# EAGLE design Messchieber_Bluetooth_2 (EAGLE 6.4)

## Sheet 1 of 3
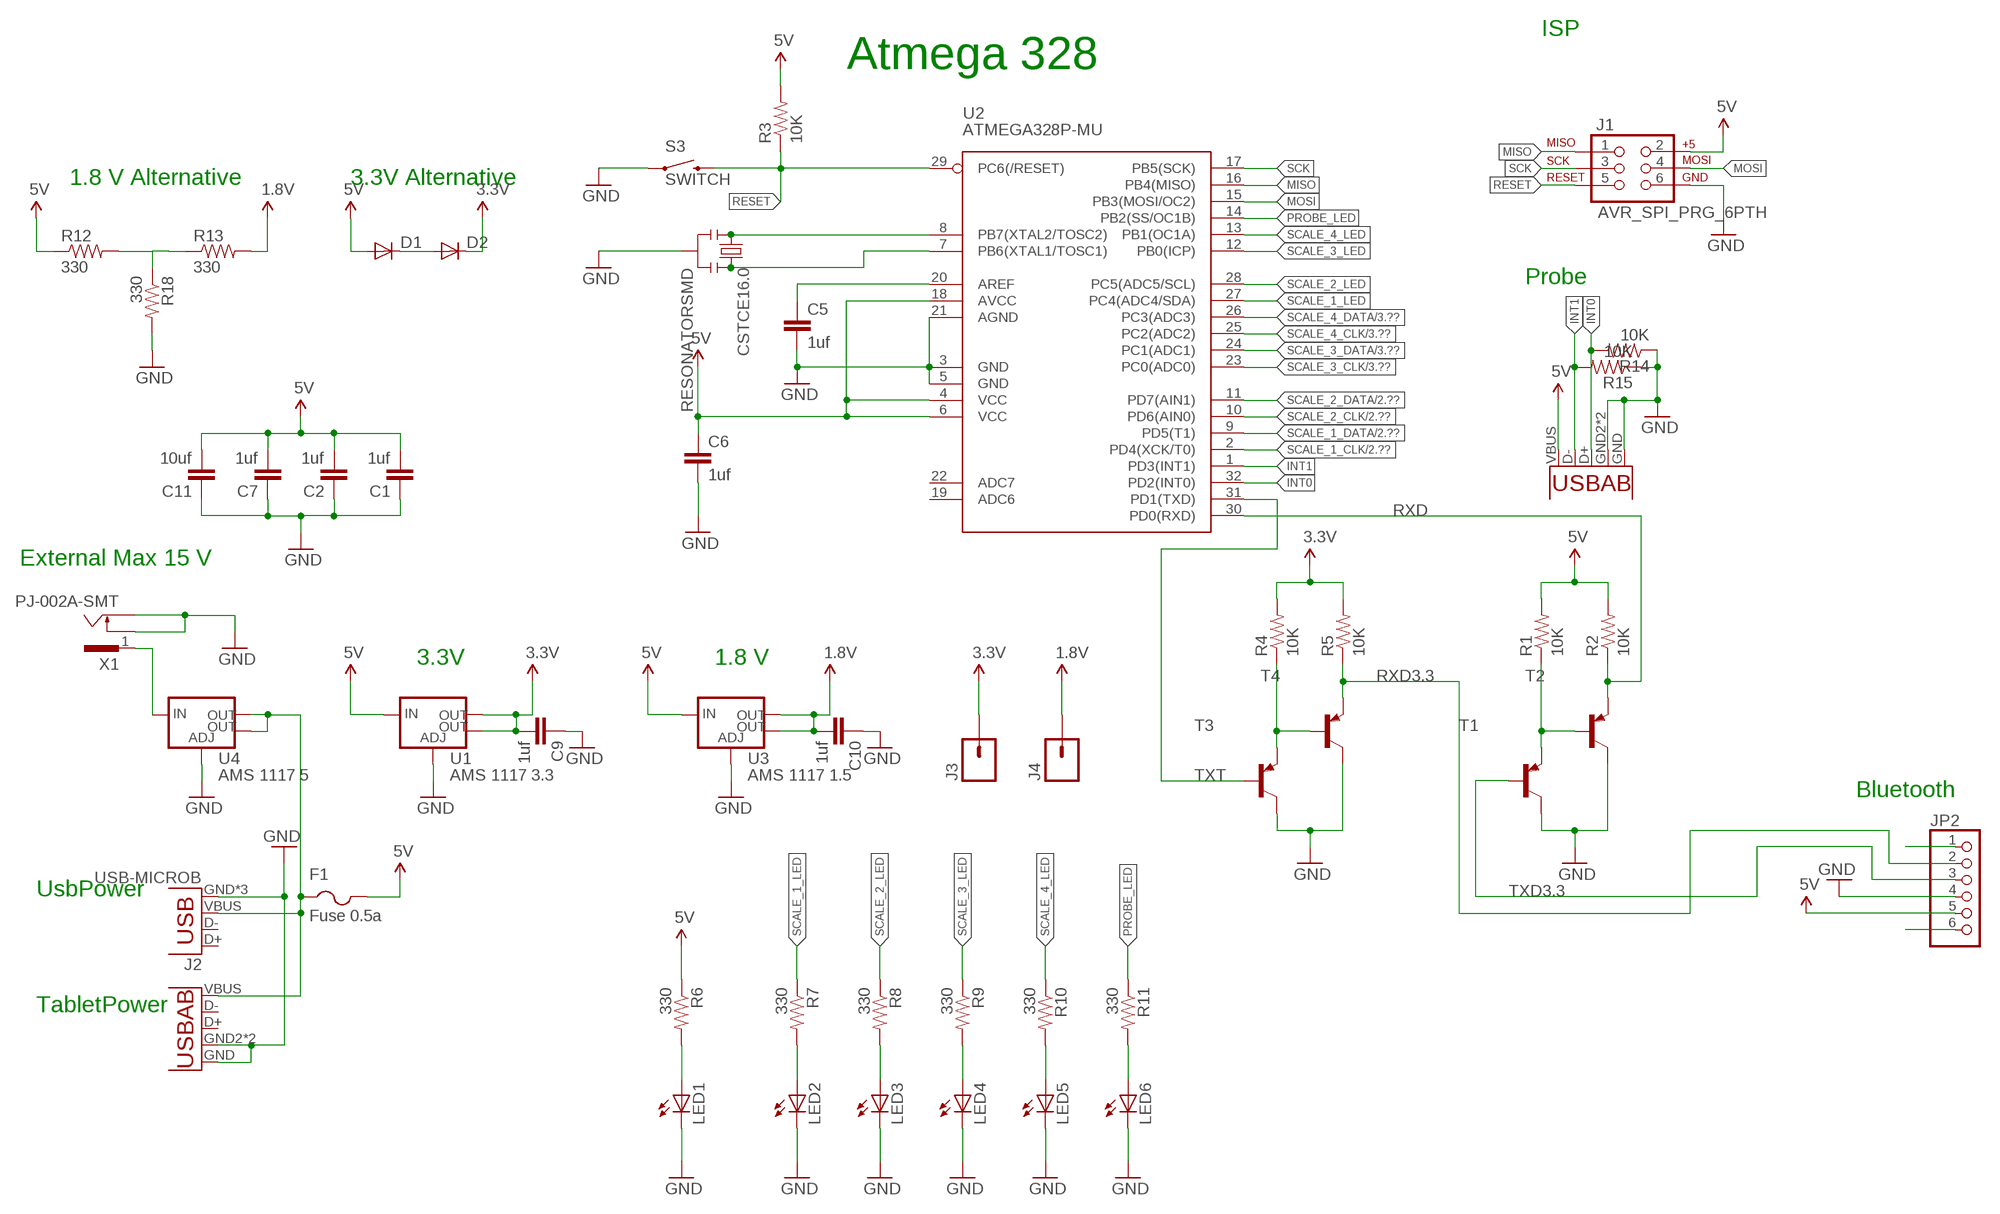
[diagram p0: schematic, sheet 1]

### Parts
C1  1uf  CAP0805  [0805]
C2  1uf  CAP0805  [0805]
C5  1uf  CAP0805  [0805]
C6  1uf  CAP0805  [0805]
C7  1uf  CAP0805  [0805]
C9  1uf  CAP0805  [0805]
C10  1uf  CAP0805  [0805]
C11  10uf  CAP0805  [0805]
CSTCE16.0  RESONATORSMD  [RESONATOR-SMD]
D1  DIODESOD  [SOD-323]
D2  DIODESOD  [SOD-323]
F1  Fuse 0.5a  PTCFUSE-1812  [1812]
J1  AVR_SPI_PRG_6PTH  [2X3]
J2  USB-MICROB  [USB-MICROB]
J3  M01PTH  [1X01]
J4  M01PTH  [1X01]
JP2  PINHD-1X6  [1X06]
LED1  LEDSML0805  [SML0805]
LED2  LEDSML0805  [SML0805]
LED3  LEDSML0805  [SML0805]
LED4  LEDSML0805  [SML0805]
LED5  LEDSML0805  [SML0805]
LED6  LEDSML0805  [SML0805]
R1  10K  RESISTOR0603-RES  [0603-RES]
R2  10K  RESISTOR0603-RES  [0603-RES]
R3  10K  RESISTOR0603-RES  [0603-RES]
R4  10K  RESISTOR0603-RES  [0603-RES]
R5  10K  RESISTOR0603-RES  [0603-RES]
R6  330  RESISTOR0603  [0603]
R7  330  RESISTOR0603  [0603]
R8  330  RESISTOR0603  [0603]
R9  330  RESISTOR0603  [0603]
R10  330  RESISTOR0603  [0603]
R11  330  RESISTOR0603  [0603]
R12  330  RESISTOR0603  [0603]
R13  330  RESISTOR0603  [0603]
R14  10K  RESISTOR0603-RES  [0603-RES]
R15  10K  RESISTOR0603-RES  [0603-RES]
R18  330  RESISTOR0603  [0603]
S3  SWITCH  SWITCH-MOMENTARY-2-SMD-1101NE  [TACTILE-SWITCH-1101NE]
T1  -PNP-SOT23-BCE  [SOT23-BCE]
T2  -PNP-SOT23-BCE  [SOT23-BCE]
T3  -PNP-SOT23-BCE  [SOT23-BCE]
T4  -PNP-SOT23-BCE  [SOT23-BCE]
U1  AMS 1117 3.3  V_REG_LM1117SOT223  [SOT223]
U2  ATMEGA328P-MU  ATMEGAXX8-AU  [TQFP32-08@1]
U3  AMS 1117 1.5  V_REG_LM1117SOT223  [SOT223]
U4  AMS 1117 5  V_REG_LM1117SOT223  [SOT223]
U$1  USB-A  [USB-A]
U$4  USB-A  [USB-A]
X1  PJ-002A-SMT  [CUI_PJ-002B-SMT]

### Nets
1.8V: C10.2 J4.1 R13.2 U3.2(OUT) U3.4(OUT) ; also sheet 2,3
3.3V: C9.2 D2.1(C) J3.1 R4.2 R5.2 U1.2(OUT) U1.4(OUT)
5V: C1.2 C2.2 C6.1 C7.2 C11.2 D1.2(A) F1.2 J1.2 JP2.5 R1.2 R2.2 R3.2 R6.1 R12.1 U1.3(IN) U2.4(VCC) U2.6(VCC) U2.18(AVCC) U3.3(IN) U$1.VBUS ; also sheet 2,3
GND: C1.1 C2.1 C5.2 C6.2 C7.1 C9.1 C10.1 C11.1 CSTCE16.0.2 J1.6 J2.GND J2.MT1(GND) J2.MT2(GND) JP2.4 LED1.C LED2.C LED3.C LED4.C LED5.C LED6.C R14.1 R15.1 R18.2 S3.P$1 T1.C T2.C T3.C T4.C U1.1(ADJ) U2.3(GND) U2.5(GND) U2.21(AGND) U3.1(ADJ) U4.1(ADJ) U$1.GND U$1.GND2(USBID) U$1.GND3(USBID) U$4.GND U$4.GND2(USBID) U$4.GND3(USBID) X1.3 X1.4 ; also sheet 2,3
INT0: R14.2 U2.32(PD2(INT0)) U$1.D+
INT1: R15.2 U2.1(PD3(INT1)) U$1.D-
MISO: J1.1 U2.16(PB4(MISO))
MOSI: J1.4 U2.15(PB3(MOSI/OC2))
N$1: C5.1 U2.20(AREF)
N$2: R1.1 T1.E T2.B
N$4: R4.1 T3.E T4.B
N$5: LED2.A R7.2
N$6: CSTCE16.0.1 U2.8(PB7(XTAL2/TOSC2))
N$7: F1.1 J2.VBUS U4.2(OUT) U4.4(OUT) U$4.VBUS
N$8: U4.3(IN) X1.1
N$9: LED3.A R8.2
N$10: LED1.A R6.2
N$12: LED4.A R9.2
N$13: LED5.A R10.2
N$16: LED6.A R11.2
N$18: CSTCE16.0.3 U2.7(PB6(XTAL1/TOSC1))
N$20: JP2.1
N$23: R12.2 R13.1 R18.1
N$24: D1.1(C) D2.2(A)
N$25: JP2.6
PROBE_LED: R11.1 U2.14(PB2(SS/OC1B))
RESET: J1.5 R3.1 S3.P$2 U2.29(PC6(/RESET))
RXD: R2.1 T2.E U2.30(PD0(RXD))
RXD3.3: JP2.2 R5.1 T4.E
SCALE_1_CLK: U2.2(PD4(XCK/T0)) ; also sheet 2
SCALE_1_DATA: U2.9(PD5(T1)) ; also sheet 2
SCALE_1_LED: R7.1 U2.27(PC4(ADC4/SDA))
SCALE_2_CLK: U2.10(PD6(AIN0)) ; also sheet 2
SCALE_2_DATA: U2.11(PD7(AIN1)) ; also sheet 2
SCALE_2_LED: R8.1 U2.28(PC5(ADC5/SCL))
SCALE_3_CLK: U2.23(PC0(ADC0)) ; also sheet 3
SCALE_3_DATA: U2.24(PC1(ADC1)) ; also sheet 3
SCALE_3_LED: R9.1 U2.12(PB0(ICP))
SCALE_4_CLK: U2.25(PC2(ADC2)) ; also sheet 3
SCALE_4_DATA: U2.26(PC3(ADC3)) ; also sheet 3
SCALE_4_LED: R10.1 U2.13(PB1(OC1A))
SCK: J1.3 U2.17(PB5(SCK))
TXD3.3: JP2.3 T1.B
TXT: T3.B U2.31(PD1(TXD))
Unconnected: J2.D+ J2.D- U2.19(ADC6) U2.22(ADC7) U$4.D+ U$4.D- X1.2

### Notes on the sheet
- ISP
- Atmega 328
- 1.8 V Alternative | 3.3V Alternative
- Probe
- External Max 15 V
- 3.3V | 1.8 V
- Bluetooth
- UsbPower
- TabletPower

## Sheet 2 of 3
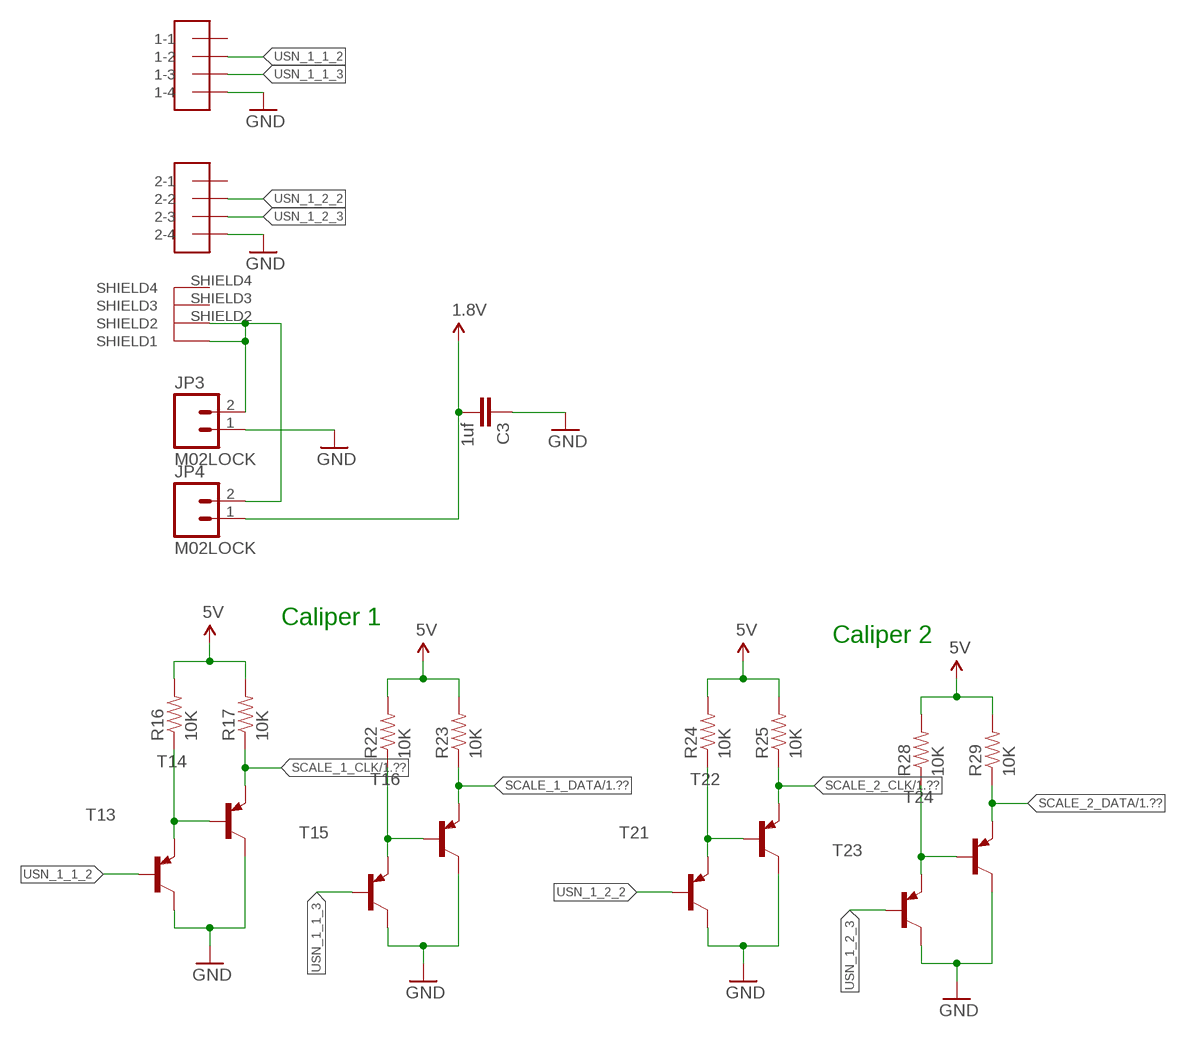
[diagram p1: schematic, sheet 2]

### Parts
C3  1uf  CAP0805  [0805]
JP3  M02LOCK  [1X02_LOCK]
JP4  M02LOCK  [1X02_LOCK]
R16  10K  RESISTOR0603-RES  [0603-RES]
R17  10K  RESISTOR0603-RES  [0603-RES]
R22  10K  RESISTOR0603-RES  [0603-RES]
R23  10K  RESISTOR0603-RES  [0603-RES]
R24  10K  RESISTOR0603-RES  [0603-RES]
R25  10K  RESISTOR0603-RES  [0603-RES]
R28  10K  RESISTOR0603-RES  [0603-RES]
R29  10K  RESISTOR0603-RES  [0603-RES]
T13  -PNP-SOT23-BCE  [SOT23-BCE]
T14  -PNP-SOT23-BCE  [SOT23-BCE]
T15  -PNP-SOT23-BCE  [SOT23-BCE]
T16  -PNP-SOT23-BCE  [SOT23-BCE]
T21  -PNP-SOT23-BCE  [SOT23-BCE]
T22  -PNP-SOT23-BCE  [SOT23-BCE]
T23  -PNP-SOT23-BCE  [SOT23-BCE]
T24  -PNP-SOT23-BCE  [SOT23-BCE]
U$2  USB-A-2  [USB-A-2]

### Nets
1.8V: C3.2 JP4.1 ; also sheet 1,3
5V: R16.2 R17.2 R22.2 R23.2 R24.2 R25.2 R28.2 R29.2 ; also sheet 1,3
GND: C3.1 JP3.1 T13.C T14.C T15.C T16.C T21.C T22.C T23.C T24.C U$2.1-4(USB-XA:1-4) U$2.2-4(USB-XB:2-4) ; also sheet 1,3
N$3: JP3.2 JP4.2 U$2.SHIELD1(SHIELD:SHIELD1) U$2.SHIELD2(SHIELD:SHIELD2)
N$11: R16.1 T13.E T14.B
N$14: R22.1 T15.E T16.B
N$15: R24.1 T21.E T22.B
N$17: R28.1 T23.E T24.B
SCALE_1_CLK: R17.1 T14.E ; also sheet 1
SCALE_1_DATA: R23.1 T16.E ; also sheet 1
SCALE_2_CLK: R25.1 T22.E ; also sheet 1
SCALE_2_DATA: R29.1 T24.E ; also sheet 1
USN_1_1_2: T13.B U$2.1-2(USB-XA:1-2)
USN_1_1_3: T15.B U$2.1-3(USB-XA:1-3)
USN_1_2_2: T21.B U$2.2-2(USB-XB:2-2)
USN_1_2_3: T23.B U$2.2-3(USB-XB:2-3)
Unconnected: U$2.1-1(USB-XA:1-1) U$2.2-1(USB-XB:2-1) U$2.SHIELD3(SHIELD:SHIELD3) U$2.SHIELD4(SHIELD:SHIELD4)

### Notes on the sheet
- Caliper 1
- Caliper 2

## Sheet 3 of 3
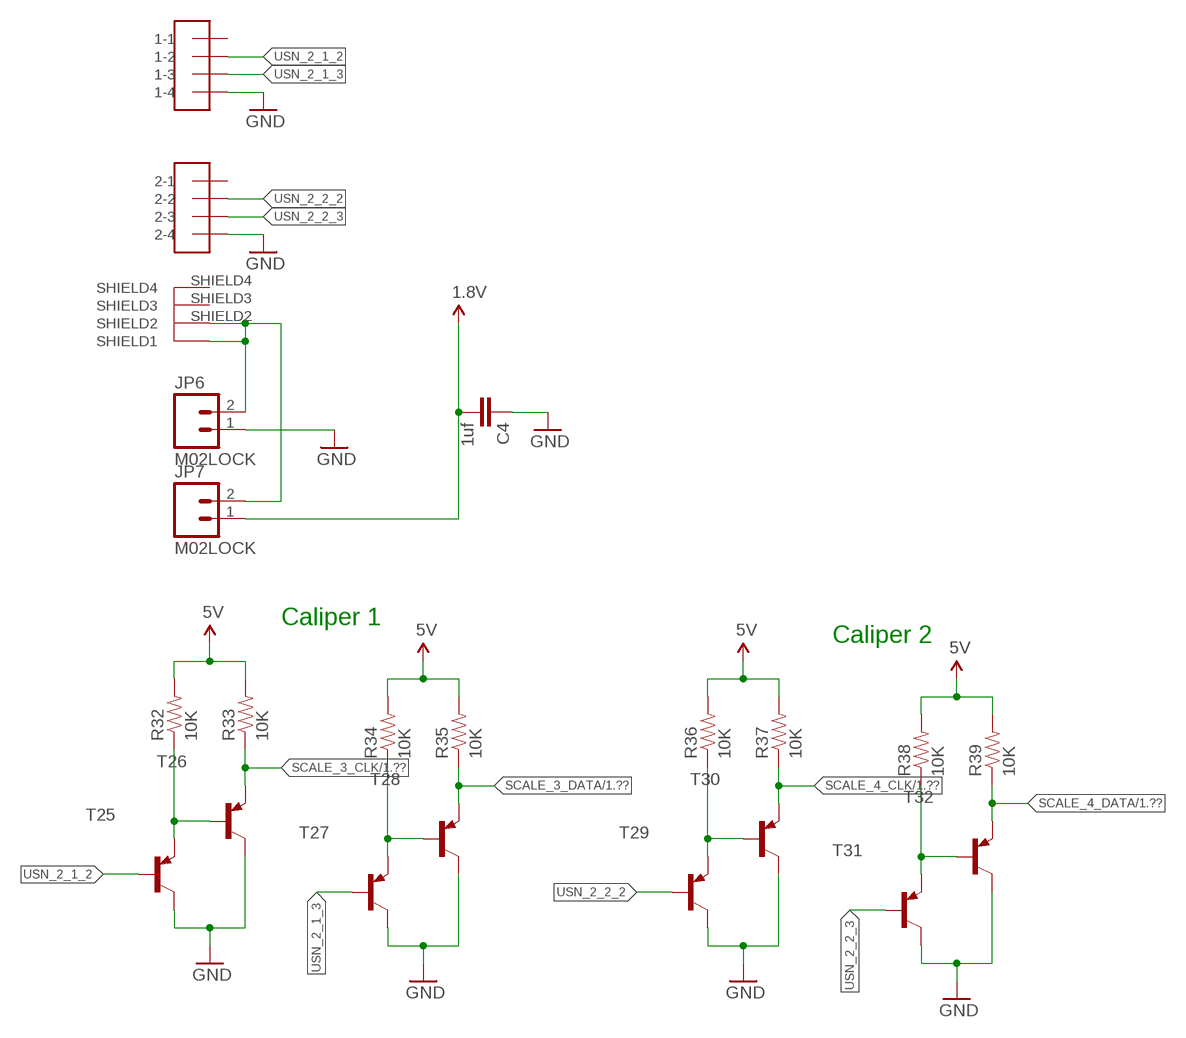
[diagram p2: schematic, sheet 3]

### Parts
C4  1uf  CAP0805  [0805]
JP6  M02LOCK  [1X02_LOCK]
JP7  M02LOCK  [1X02_LOCK]
R32  10K  RESISTOR0603-RES  [0603-RES]
R33  10K  RESISTOR0603-RES  [0603-RES]
R34  10K  RESISTOR0603-RES  [0603-RES]
R35  10K  RESISTOR0603-RES  [0603-RES]
R36  10K  RESISTOR0603-RES  [0603-RES]
R37  10K  RESISTOR0603-RES  [0603-RES]
R38  10K  RESISTOR0603-RES  [0603-RES]
R39  10K  RESISTOR0603-RES  [0603-RES]
T25  -PNP-SOT23-BCE  [SOT23-BCE]
T26  -PNP-SOT23-BCE  [SOT23-BCE]
T27  -PNP-SOT23-BCE  [SOT23-BCE]
T28  -PNP-SOT23-BCE  [SOT23-BCE]
T29  -PNP-SOT23-BCE  [SOT23-BCE]
T30  -PNP-SOT23-BCE  [SOT23-BCE]
T31  -PNP-SOT23-BCE  [SOT23-BCE]
T32  -PNP-SOT23-BCE  [SOT23-BCE]
U$3  USB-A-2  [USB-A-2]

### Nets
1.8V: C4.2 JP7.1 ; also sheet 1,2
5V: R32.2 R33.2 R34.2 R35.2 R36.2 R37.2 R38.2 R39.2 ; also sheet 1,2
GND: C4.1 JP6.1 T25.C T26.C T27.C T28.C T29.C T30.C T31.C T32.C U$3.1-4(USB-XA:1-4) U$3.2-4(USB-XB:2-4) ; also sheet 1,2
N$19: JP6.2 JP7.2 U$3.SHIELD1(SHIELD:SHIELD1) U$3.SHIELD2(SHIELD:SHIELD2)
N$21: R32.1 T25.E T26.B
N$22: R34.1 T27.E T28.B
N$26: R36.1 T29.E T30.B
N$27: R38.1 T31.E T32.B
SCALE_3_CLK: R33.1 T26.E ; also sheet 1
SCALE_3_DATA: R35.1 T28.E ; also sheet 1
SCALE_4_CLK: R37.1 T30.E ; also sheet 1
SCALE_4_DATA: R39.1 T32.E ; also sheet 1
USN_2_1_2: T25.B U$3.1-2(USB-XA:1-2)
USN_2_1_3: T27.B U$3.1-3(USB-XA:1-3)
USN_2_2_2: T29.B U$3.2-2(USB-XB:2-2)
USN_2_2_3: T31.B U$3.2-3(USB-XB:2-3)
Unconnected: U$3.1-1(USB-XA:1-1) U$3.2-1(USB-XB:2-1) U$3.SHIELD3(SHIELD:SHIELD3) U$3.SHIELD4(SHIELD:SHIELD4)

### Notes on the sheet
- Caliper 1
- Caliper 2

## Library data of the parts
C1-C7 C9-C11 = SparkFun-Capacitors:CAP: Capacitor Standard 0603 ceramic capacitor, and 0.1" leaded capacitor.
CSTCE16.0 = SparkFun:RESONATOR: Resonator Small SMD resonator. This is the itty bitty 10/20MHz resonators with built in caps. CSTCE10M0G55 and CSTCE20M0V53. Footprint has been reviewed closely but hasn't been tested yet.
D1 D2 = SparkFun:DIODE: Diode These are standard reverse protection diodes and small signal diodes. SMA package can handle up to about 1A. SOD-323 can handle about 200mA. What the SOD-323 package when ordering, there are some mfgs out there that are 5-pin packages.
F1 = adafruit:PTCFUSE: PTC fuses, resettable thermistors
J1 = SparkFun-Connectors:AVR_SPI_PRG_6: AVR ISP 6 Pin This is the reduced ISP connector for AVR programming. Common on Arduino. This footprint will take up less PCB space and can be used with a 10-pin to 6-pin adapter such as SKU: BOB-08508
J2 = SparkFun-Connectors:USB: USB Connectors USB-B-PTH is fully proven SKU : PRT-00139/CONN-08278 USB-miniB is fully proven SKU : PRT-00587 USB-A-PCB is untested. USB-A-H is throughly reviewed, but untested. Spark Fun Electronics SKU : PRT-00437 USB-B-SMT is throughly reviewed, but untested. Needs silkscreen touching up. USB-A-S has not been used/tested USB-MB-H has not been used/tested USB-MICROB has been used. CONN-09505; PROD_ID: CONN-09505
J3 J4 = SparkFun-Connectors:M01: Header 1 Standard 1-pin 0.1" header. Use with straight break away headers (SKU : PRT-00116), right angle break away headers (PRT-00553), swiss pins (PRT-00743), machine pins (PRT-00117), and female headers (PRT-00115). SMTSO-256-ET is a "flush mount" nut for a 4-40 screw. The older package used to be too tight, and did not allow it to sit properly thru the drill hit. The latest (0.165DIA) fits nice and snug.
JP2 = pinhead:PINHD-1X6: PIN HEADER
JP3 JP4 JP6 JP7 = SparkFun-Connectors:M02: Standard 2-pin 0.1" header. Use with - straight break away headers ( PRT-00116) - right angle break away headers (PRT-00553) - swiss pins (PRT-00743) - machine pins (PRT-00117) - female headers (PRT-00115) Molex polarized connector foot print use with: PRT-08233 with associated crimp pins and housings. 2.54_SCREWTERM for use with PRT-10571. 3.5mm Screw Terminal footprints for PRT-08084 5mm Screw Terminal footprints for use with PRT-08433
LED1-LED6 = led:LED: LED OSRAM: - CHIPLED LG R971, LG N971, LY N971, LG Q971, LY Q971, LO R971, LY R971 LH N974, LH R974 LS Q976, LO Q976, LY Q976 LO Q996 - Hyper CHIPLED LW Q18S LB Q993, LB Q99A, LB R99A - SideLED LS A670, LO A670, LY A670, LG A670, LP A670 LB A673, LV A673, LT A673, LW A673 LH A674 LY A675 LS A676, LA A676, LO A676, LY A676, LW A676 LS A679, LY A679, LG A679 - Hyper Micro SIDELED® LS Y876, LA Y876, LO Y876, LY Y876 LT Y87S - SmartLED LW L88C, LW L88S LB L89C, LB L89S, LG L890 LS L89K, LO L89K, LY L89K LS L896, LA L896, LO L896, LY L896 - TOPLED LS T670, LO T670, LY T670, LG T670, LP T670 LSG T670, LSP T670, LSY T670, LOP T670, LYG T670 LG T671, LOG T671, LSG T671 LB T673, LV T673, LT T673, LW T673 LH T674 LS T676, LA T676, LO T676, LY T676, LB T676, LH T676, LSB T676, LW T676 LB T67C, LV T67C, LT T67C, LS T67K, LO T67K, LY T67K, LW E67C LS E67B, LA E67B, LO E67B, LY E67B, LB E67C, LV E67C, LT E67C LW T67C LS T679, LY T679, LG T679 LS T770, LO T770, LY T770, LG T770, LP T770 LB T773, LV T773, LT T773, LW T773 LH T774 LS E675, LA E675, LY E675, LS T675 LS T776, LA T776, LO T776, LY T776, LB T776 LHGB T686 LT T68C, LB T68C - Hyper Mini TOPLED® LB M676 - Mini TOPLED Santana® LG M470 LS M47K, LO M47K, LY M47K Source: http://www.osram.convergy.de LUXEON: - LUMILED® LXK2-PW12-R00, LXK2-PW12-S00, LXK2-PW14-U00, LXK2-PW14-V00 LXK2-PM12-R00, LXK2-PM12-S00, LXK2-PM14-U00 LXK2-PE12-Q00, LXK2-PE12-R00, LXK2-PE12-S00, LXK2-PE14-T00, LXK2-PE14-U00 LXK2-PB12-K00, LXK2-PB12-L00, LXK2-PB12-M00, LXK2-PB14-N00, LXK2-PB14-P00, LXK2-PB14-Q00 LXK2-PR12-L00, LXK2-PR12-M00, LXK2-PR14-Q00, LXK2-PR14-R00 LXK2-PD12-Q00, LXK2-PD12-R00, LXK2-PD12-S00 LXK2-PH12-R00, LXK2-PH12-S00 LXK2-PL12-P00, LXK2-PL12-Q00, LXK2-PL12-R00 Source: www.luxeon.com KINGBRIGHT: KA-3528ASYC Source: www.kingbright.com
R1-R5 R14-R17 R22-R25 R28 R29 R32-R39 = SparkFun-Resistors:RESISTOR: Resistor
R6-R13 R18 = SparkFun:RESISTOR: Resistor
S3 = SparkFun-Electromechanical:SWITCH-MOMENTARY-2: Various NO switches- pushbuttons, reed, etc
T1-T4 T13-T16 T21-T32 = transistor:*-PNP-: PNP Transistror
U1 U3 U4 = SparkFun-PowerIC:V_REG_LM1117: Voltage Regulator LM1117 Standard adjustable voltage regulator but in SMD form. Spark Fun Electronics SKU : COM-00595; PROD_ID: VREG-08170
U2 = Smartprj:ATMEGAXX8: MICROCONTROLLER 8 Kbytes FLASH 1 kbytes SRAM 512 bytes EEPROM USART 6-channel 10 bit ADC 2-channel 8 bit ADC Source: avr.lbr
U$1 U$4 = andi:USB-A
U$2 U$3 = usb:USB-A-2: Reichelt USB AW-2 http://www.reichelt.de/USB-FireWire-Verbinder/USB-AW-2/index.html?;ACTION=3;LA=444;GROUP=C1C;GROUPID=5208;ARTICLE=52004;START=0;SORT=id;OFFSET=100;SID=11TVAtpH8AAAIAAFKOLUob7739b188f91ab8cc657b33b81a56c4a
X1 = con-cui-inc:PJ-002A-SMT

## Net classes
0 default: width 0.203 mm, clearance 0.205 mm

## Board
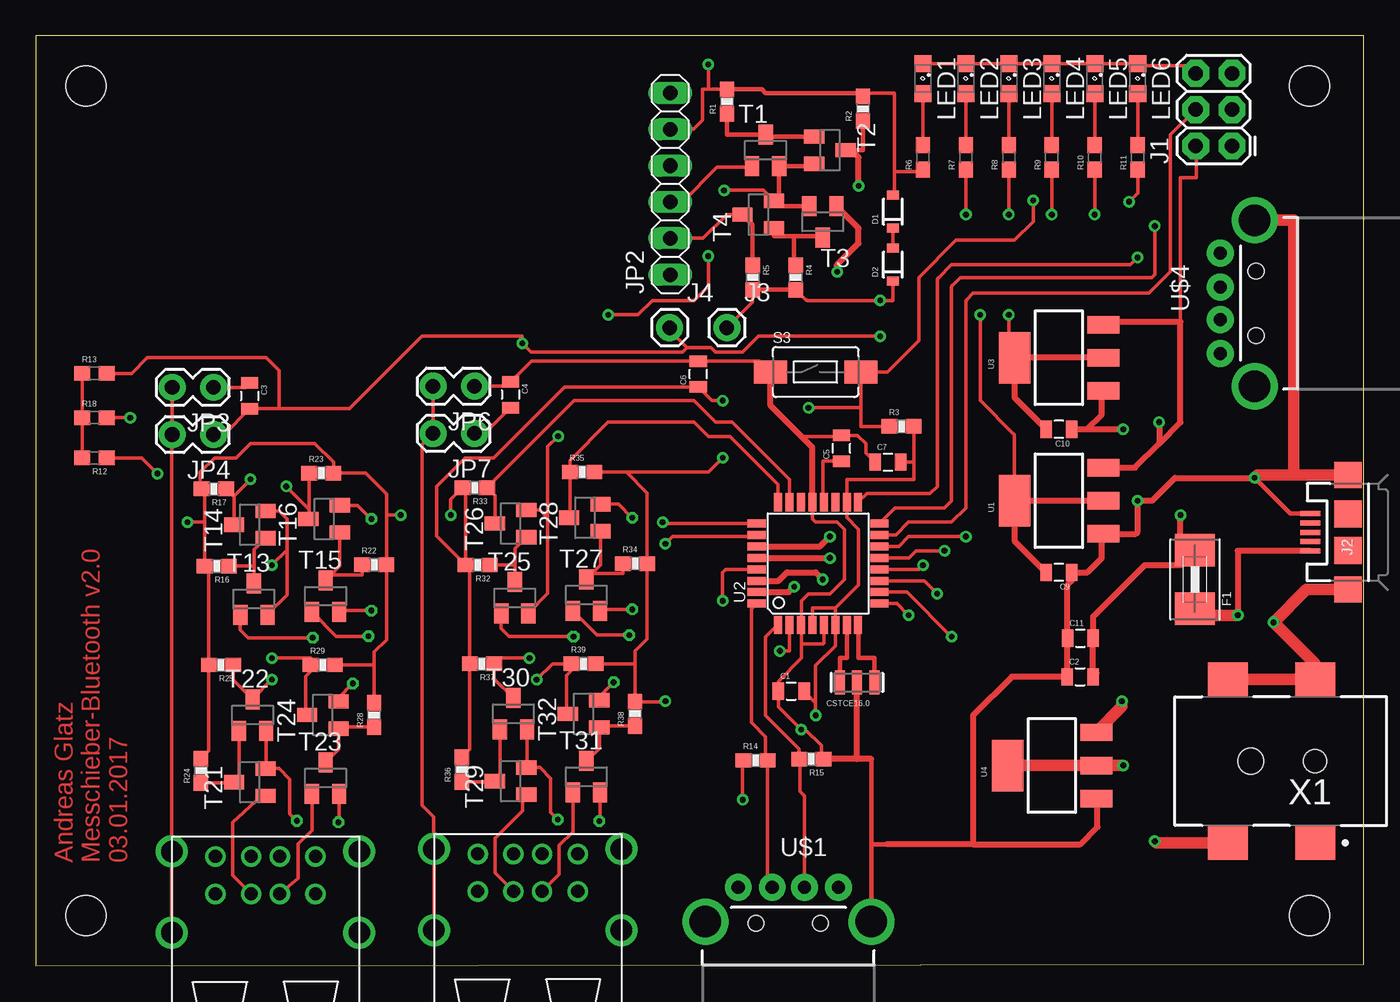
[diagram p3: board, top side]
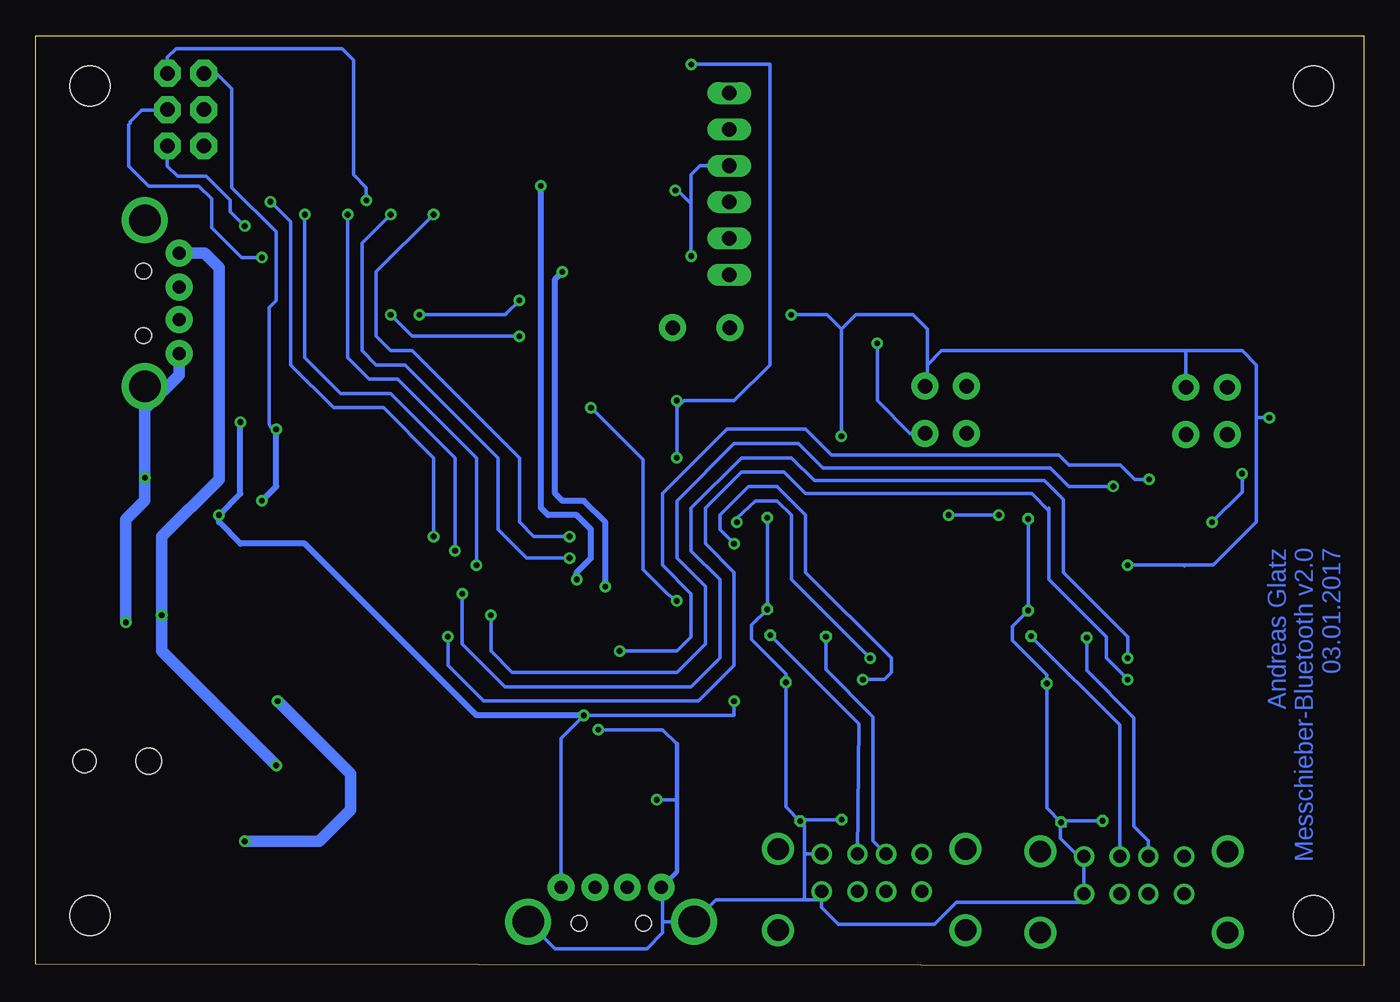
[diagram p4: board, bottom side, seen from below]

Size 92.8 x 65 mm. Coordinates in mm from the lower left corner, seen from the top.
Outline: 0,0 92.8,0.1 92.8,65 0,65 0,0
Copper layers (1*16): Top 0.035mm / dielectric 1.5mm / Bottom 0.035mm
Design rules "bilex-lp-eagle-rules": minimum track width 10mil, minimum drill 0.4mm, track to track 10mil, track to pad 10mil, pad to pad 10mil, via to via 10mil, smd to smd 10mil, copper to edge 0.5mm, drill to drill 10mil, minimum pad ring 10mil, minimum via ring 8mil, stop-mask expansion 0.075mm, vias tented up to drill 0mil, thermal gap 10mil
Holes 2.8 mm at 3.5,3.5 89,61.5 3.5,61.5 89,3.5

### Footprints (pad centres in the part's own frame; a part is rotated, then mirrored left to right if it is on the bottom)
0805 = smd 0.8 x 1.2: 1 -0.9,0; 2 0.9,0
RESONATOR-SMD = smd 0.7 x 1.7: 1 -1.2,0; 2 0,0; 3 1.2,0
SOD-323 = smd 0.63 x 0.83: 1 -1.15,0; 2 1.15,0
1812 = smd 2.286 x 2.794: 1 -2.046,0; 2 2.046,0
2X3 = drill 1.016 pad 1.88 octagon: 1 0,0; 2 0,2.54; 3 2.54,0; 4 2.54,2.54; 5 5.08,0; 6 5.08,2.54
USB-MICROB = smd 0.35 x 1.4: D+ 0,2.65; D- -0.65,2.65; GND 1.3,2.65; ID 0.65,2.65; VBUS -1.3,2.65 | smd 1.8 x 1.9: MT1 -4,0; MT2 4,0 | smd 1.9 x 1.9: P$1 -1.27,0; P$2 1.27,0
1X01 = drill 1.016 pad 1.88: 1 0,0
1X06 = drill 1.016 long: 1 -6.35,0; 2 -3.81,0; 3 -1.27,0; 4 1.27,0; 5 3.81,0; 6 6.35,0
1X02_LOCK = drill 1.016 pad 1.88: 1 -0.178,0; 2 2.718,0
SML0805 = smd 1.2 x 1.2: A 1.05,0; C -1.05,0
0603-RES = smd 1.1 x 1: 1 -0.85,0; 2 0.85,0
0603 = smd 1.1 x 1: 1 -0.85,0; 2 0.85,0
TACTILE-SWITCH-1101NE = smd 2.3 x 1.6: P$1 -3.15,0; P$2 3.15,0
SOT23-BCE = smd 1 x 1.4: B -0.95,-1.1; C 0.95,-1.1; E 0,1.1
SOT223 = smd 1.219 x 2.235: 1 -2.311,-3.099; 2 0,-3.099; 3 2.311,-3.099 | smd 3.6 x 2.2: 4 0,3.099
TQFP32-08@1 = smd 1.27 x 0.559: 1 -4.293,2.8; 2 -4.293,2; 3 -4.293,1.2; 4 -4.293,0.4; 5 -4.293,-0.4; 6 -4.293,-1.2; 7 -4.293,-2; 8 -4.293,-2.8; 17 4.293,-2.8; 18 4.293,-2; 19 4.293,-1.2; 20 4.293,-0.4; 21 4.293,0.4; 22 4.293,1.2; 23 4.293,2; 24 4.293,2.8 | smd 0.559 x 1.27: 9 -2.8,-4.293; 10 -2,-4.293; 11 -1.2,-4.293; 12 -0.4,-4.293; 13 0.4,-4.293; 14 1.2,-4.293; 15 2,-4.293; 16 2.8,-4.293; 25 2.8,4.293; 26 2,4.293; 27 1.2,4.293; 28 0.4,4.293; 29 -0.4,4.293; 30 -1.2,4.293; 31 -2,4.293; 32 -2.8,4.293
USB-A = drill 0.914 pad 1.88: D+ 10.02,1.127; D- 10.02,-1.127; GND 10.02,3.5; VBUS 10.02,-3.5 | drill 2.2: GND2 7.62,-5.8; GND3 7.62,5.8 | hole 1.1: 7.52,2.25; 7.52,-2.25
USB-A-2 = drill 0.92: 1-1 -3.5,-1.39; 1-2 -1,-1.39; 1-3 1,-1.39; 1-4 3.5,-1.39; 2-1 -3.5,-4.01; 2-2 -1,-4.01; 2-3 1,-4.01; 2-4 3.5,-4.01 | drill 1.5: SHIELD1 -6.55,-1.04; SHIELD2 -6.55,-6.72; SHIELD3 6.55,-6.72; SHIELD4 6.55,-1.04
CUI_PJ-002B-SMT = smd 2.4 x 2.8: 1 -5.7,11.1; 2 -5.7,5; 3 5.7,5; 4 5.7,11.1 | hole 1.8: 0,9.5 | hole 1.6: 0,5

### Placement (x,y rotation side)
C1  52.79,19.2 0 top
C2  72.98,20.2 0 top
C3  14.95,39.83 270 top
C4  33.18,39.91 270 top
C5  56.3,36.17 90 top
C6  46.3,41.36 90 top
C7  59.55,35.2 0 top
C9  71.5,27.5 180 top
C10  71.5,37.5 180 top
C11  73,22.9 0 top
CSTCE16.0  57.4,19.8 180 top
D1  59.9,52.7 90 top
D2  59.9,49 90 top
F1  81,27 90 top
J1  83.6,57.3 90 top
J2  91.7,30.3 90 top
J3  48.3,44.6 0 top
J4  44.3,44.6 0 top
JP2  44.33,54.65 90 top
JP3  12.25,40.43 180 top
JP4  12.25,37.13 180 top
JP6  30.48,40.51 180 top
JP7  30.48,37.21 180 top
LED1  62,62 270 top
LED2  65,62 270 top
LED3  68,62 270 top
LED4  71,62 270 top
LED5  74,62 270 top
LED6  77,62 270 top
R1  48.3,60.4 90 top
R2  57.8,59.9 90 top
R3  60.5,37.7 0 top
R4  53.1,48.1 270 top
R5  50.1,48.1 270 top
R6  62,56.5 90 top
R7  65,56.5 90 top
R8  68,56.5 90 top
R9  71,56.5 90 top
R10  74,56.5 90 top
R11  77,56.5 90 top
R12  4.1,35.5 180 top
R13  4.1,41.4 0 top
R14  50.3,14.36 0 top
R15  54.2,14.45 180 top
R16  12.65,27.93 180 top
R17  12.45,33.33 180 top
R18  4.1,38.3 0 top
R22  23.65,28.03 0 top
R23  19.95,34.43 0 top
R24  11.55,13.63 90 top
R25  12.95,21.03 180 top
R28  23.65,17.53 90 top
R29  20.05,21.03 0 top
R32  30.88,28.01 180 top
R33  30.68,33.41 180 top
R34  41.88,28.11 0 top
R35  38.18,34.51 0 top
R36  29.78,13.71 90 top
R37  31.18,21.11 180 top
R38  41.88,17.61 90 top
R39  38.28,21.11 0 top
S3  54.5,41.5 0 top
T1  51,57 0 top
T2  55.5,57 270 top
T3  55,52 180 top
T4  50.5,52.5 90 top
T13  15.25,25.63 0 top
T14  14.95,30.83 90 top
T15  20.25,25.83 0 top
T16  20.15,31.23 90 top
T21  14.95,12.83 90 top
T22  15.15,17.53 0 top
T23  20.25,13.13 0 top
T24  20.05,17.53 90 top
T25  33.48,25.71 0 top
T26  33.18,30.91 90 top
T27  38.48,25.91 0 top
T28  38.38,31.31 90 top
T29  33.18,12.91 90 top
T30  33.38,17.61 0 top
T31  38.48,13.21 0 top
T32  38.28,17.61 90 top
U1  71.5,32.5 90 top
U2  54.67,28.11 90 top
U3  71.5,42.5 90 top
U4  71,14 90 top
U$1  52.59,-4.54 90 top
U$2  16.05,9.03 0 top
U$3  34.38,9.21 0 top
U$4  92.8,46.3 180 top
X1  94.4,14.3 90 top

### Tracks (layer width: path | path; a pad name or v marks a point on that pad's centre or on a via)
1.8V  (via drill 0.4)
  Top 0.254: JP4.1 13.15,37.13 C3.2 17,38.93 | JP7.1 31.38,37.21 C4.2 | 17,38.93 21.93,38.93 27,44 34,44 v34,43.5 34.6,42.9 45.2,42.9 45.5,43.2 | v68,45.5 68,42.9 U3.4 | v59,44 50.5,44 49.4,42.9 47.5,42.9 47.2,43.2 45.5,43.2 | J4.1 44.3,44.4 45.5,43.2 | R13.2 6.7,41.4 7.8,42.5 16.1,42.5 17,41.6 17,38.93
  Top 0.406: C10.2 68.4,39.7 U3.4 U3.2
  Bottom 0.254: v59,44 66.5,44 v68,45.5 | JP7.1 31.71,37.21 34,39.5 v34,43.5
3.3V  (via drill 0.4)
  Top 0.254: U1.4 68.4,36.99 arc45 68.33,37.17 66,39.5 v66,45.5 | R4.2 53.78,46.57 arc45 53.95,46.5 v59,46.5 59.9,46.5 D2.1 | R5.2 50.1,46.4 J3.1
  Top 0.305: R5.2 R4.2
  Top 0.406: C9.2 68.4,29.7 U1.4 U1.2
  Bottom 0.254: v66,45.5 60.1,45.5 arc-45 59.93,45.57 v59,46.5
5V  (via drill 0.4)
  Top 0.254: R24.2 12.1,15.03 R25.2 12.1,27.63 R16.2 11.8,30.9 | 11.8,30.9 11.8,33.13 R17.2 | R28.2 23.65,21.03 | 23.65,21.03 23.65,21.93 24.5,22.78 R22.2 24.5,31.5 | 24.5,31.5 24.5,32.98 | 24.5,32.98 23.05,34.43 R23.2 20.8,35.2 19.5,36.5 15,36.5 14,35.5 12.5,35.5 11.5,34.5 11.5,33.43 R17.2 | R17.2 11.85,33.58 | R29.2 23.65,21.03 | R36.2 30.33,15.11 R37.2 30.33,27.71 R32.2 | R32.2 30.03,33.21 R33.2 | 41.88,21.11 41.88,22.01 42.73,22.86 R34.2 42.73,33.06 41.28,34.51 R35.2 47.01,34.51 v48,35.5 | R33.2 30.08,33.66 | R39.2 41.88,21.11 | 55.87,25 U2.6 55.87,22.37 54.5,21 v54.5,17.5 54.5,18.39 C1.2 | U2.4 54.27,25 55.87,25 | 61.35,35.2 R3.2 | 61.35,35.2 61.35,34 56.67,34 U2.18 56.67,31.33 57.5,30.5 57.5,26.63 55.87,25 | 61.35,35.2 C7.2 | v44,18.5 43.96,18.46 R38.2 41.88,21.11 | 24.5,32.98 24.52,32.98 | v29,31.5 29,32.58 R33.2 | R6.1 61.85,55.5 60,55.5 | 60,55.5 60,61 58.05,61 arc90 R2.2 | R1.2 47,61.25 | 47,61.25 v47,63 | R32.2 28,30.04 28,33.5 30,35.5 32,35.5 36.96,40.46 C6.1 47.26,39.5 v48,39.5 | v25.5,31.5 24.5,31.5 | JP2.5 45.96,58.46 46.6,59.1 46.6,61.25 47,61.25 | J1.2 81.1,57.26 81.1,55.1 80,55.1 80,45 | D1.2 60,53.85 60,55.5 | R12.1 7.4,35.5 v8.5,34.4 | v10.6,31 11.7,31 11.8,30.9
  Top 0.305: R2.2 arc90 57.55,61 51,61 50.75,61.25 R1.2
  Top 0.406: U3.3 74.79,45 80,45 80,38 78.5,36.5 | U1.3 76.81,34.81 78.5,36.5 | 74.14,20.46 C2.2 73.88,22.88 C11.2 73.9,24.4 77.5,28 79.95,28 F1.2 80,30.05 v80,31.5 | v78.5,38 78.5,36.5
  Bottom 0.254: v44,18.5 44,17.5 v54.5,17.5 56.09,15.91 U$1.VBUS | v25.5,31.5 v29,31.5 | v47,63 41.5,63 41.5,42 44,39.5 47.5,39.5 48,39 | v48,35.5 48,39 | 48,39 v48,39.5 | v8.5,34.4 8.5,33.1 v10.6,31
  Bottom 0.406: v78.5,38 78.5,33 v80,31.5 80,31 78.5,29.5 74,29.5 62,17.5 v54.5,17.5
GND  (via drill 0.4)
  Top 0.254: T22.C 16.1,13.83 T21.C 17,13.78 17.75,13.03 17.75,10.63 v18.25,10.13 | T23.C 21.2,10.03 v21.15,10.03 | T24.C 21.15,18.73 v22.15,19.73 | v23.45,24.83 21.3,24.83 T15.C | T16.C 22.5,32.18 v23.45,31.23 | T13.C 16.2,24.58 17.55,25.93 17.55,29.05 | T14.C 17,31.78 17.55,31.23 17.55,29.05 | JP3.1 14.65,40.43 C3.1 | T30.C 34.33,13.91 T29.C 35.23,13.86 35.98,13.11 35.98,10.71 v36.48,10.21 | T31.C 39.43,10.11 v39.38,10.11 | T32.C 39.38,18.81 v40.38,19.81 | v41.68,24.91 39.53,24.91 T27.C | T28.C 40.73,32.26 v41.68,31.31 | T25.C 34.43,24.66 35.78,26.01 35.78,31.31 | 35.78,31.31 35.23,31.86 T26.C | JP6.1 32.88,40.51 33,40.63 33,41 C4.1 34.63,42.26 C6.2 50.59,42.26 S3.P$1 | 49.09,14 R14.1 49.4,14.36 v49.4,11.6 | 53.5,37 56.3,37 C5.2 57.43,37.07 58,36.5 58,35.85 C7.1 | 53.5,22.5 55,22.5 55.07,22.57 U2.5 | U2.21 54.27,31.23 54.5,31 56,31 56.5,30.5 56.5,27 55.5,26 54,26 53.5,25.5 53.5,23.82 U2.3 53.5,23.79 53.5,22.5 | 53.5,22.5 53.5,21.5 51.89,19.89 C1.1 51.89,18.11 v53.5,16.5 53.8,16.5 54.9,15.4 54.9,14.6 R15.1 | 17.55,29.05 v16.5,28 | LED6.C LED5.C LED4.C LED3.C LED2.C LED1.C LED6.C | 35.78,31.31 35.78,36.28 v36.5,37 | LED6.C 77.45,63.05 | v47,49.6 47,47.5 46,46.5 43.1,46.5 42.1,45.5 v40,45.5 | v48.1,54.2 50.85,54.2 T4.C | LED6.C 77.15,62.9 80.54,62.9 J1.6 | R18.2 v6.6,38.3
  Top 0.305: T2.C 54.4,55.9 T1.C 51.95,53.45 T4.C 51.6,53.1 T3.C | U$1.GND2 58.39,8.5 | 58.39,8.5 58.39,14.45 | 59.51,8.5 58.39,8.5 | J2.GND 87.68,31.6 v85.18,34.1
  Top 0.406: 65.5,8.5 65.5,17.5 68.2,20.2 C2.1 72.08,22.88 C11.1 72.1,26.6 72.4,26.9 C9.1 73.5,27.5 74.5,28.5 74.5,30.09 U1.1 76.87,30.19 77,30.32 v77,32.5 78,32.5 79.6,34.1 v85.18,34.1 | 65.5,8.5 59.51,8.5 | 57.4,14.45 R15.1 | 58.39,14.45 57.4,14.45 | 57.4,14.45 CSTCE16.0.2 | U2.21 54.27,36.23 53.5,37 51.35,39.15 S3.P$1 | C10.1 73.5,37.5 | 73.5,37.5 74.5,38.5 74.5,40.09 U3.1 | 73.5,37.5 v76,37.5 | 65.5,8.5 73,8.5 74.2,9.7 74.2,11.59 U4.1
  Top 0.813: 74.5,11.5 74.1,11.5 U4.1 | X1.4 X1.3 89.4,21.1 v86.5,24 88.8,26.3 J2.MT1 | J2.MT2 87.9,34.3 | 87.9,34.3 85.38,34.3 v85.18,34.1 | U$4.GND2 87.9,52.1 87.9,34.3
  Bottom 0.254: v21.15,10.03 21.15,10.13 v18.25,10.13 | 20.85,9.73 v21.15,10.03 | v21.15,10.03 22.15,11.03 v22.15,19.73 22.15,20.33 24.55,22.73 24.55,23.73 v23.45,24.83 v23.45,31.23 | v39.38,10.11 39.38,10.21 v36.48,10.21 | v39.38,10.11 39.08,9.81 39.08,7.7 | v39.38,10.11 40.38,11.11 v40.38,19.81 40.38,20.41 42.78,22.81 42.78,23.81 v41.68,24.91 v41.68,31.31 | v53.5,16.5 49,16.5 48,15.5 | v16.5,28 12.5,28 | 12.5,28 10.5,28 7.5,31 7.5,38.3 | 7.5,38.3 7.5,42 8.5,43 12.5,43 | 12.5,40.5 JP3.1 12.43,42.93 12.5,43 | 12.5,43 29.5,43 30.5,42 | 30.5,42 30.5,40.67 JP6.1 | 12.55,27.95 12.5,28 | v36.5,37 36.5,44.5 | 30.5,42 30.5,44.5 31.5,45.5 35.5,45.5 36.5,44.5 | 36.5,44.5 37.5,45.5 v40,45.5 | 47,53.25 v47,49.6 | 47,53.25 47.95,54.2 v48.1,54.2 | JP2.4 46.38,55.92 47,55.3 47,53.25 | 39.08,4.6 39.08,7.7 | v21.15,10.03 21.2,9.98 21.2,8.9 19.55,7.25 U$2.1-4 U$2.2-4 19.62,4.45 28.45,4.45 30,2.9 36.7,2.9 37.9,4.1 37.9,4.5 | 48,11.8 48,11.6 v49.4,11.6 | 39.08,4.6 45.27,4.6 U$1.GND3 49,3.08 | 49,3.08 49,5.4 | 37.9,4.5 37.9,5.18 U$3.2-4 | 39.08,4.6 38,4.6 37.9,4.5 | U$3.1-4 38.96,7.82 39.08,7.7 | J1.6 80.18,62.38 79.1,61.3 79.1,54.4 76,51.3 76,46.5 76.5,46 76.5,38 arc-90 v76,37.5 | v6.6,38.3 7.5,38.3 | 49,3.08 49,2.3 50.1,1.2 56.51,1.2 U$1.GND2
  Bottom 0.305: 48,15.5 48,11.6 48,6.57 U$1.GND
  Bottom 0.406: v77,32.5 76,33.5 v76,37.5
  Bottom 0.813: v86.5,24 86.5,31.2 85.18,32.52 v85.18,34.1 U$4.GND3 85.08,39 82.78,41.3 U$4.GND
INT0
  Top 0.254: U2.32 50,24.93 50,17 51,16 51,14.51 R14.2 51.15,5.79 U$1.D+
INT1
  Top 0.254: R15.2 53.72,14.08 | U2.1 51.82,23.82 51,23 51,17.5 53.35,15.15 R15.2 | U$1.D- 53.72,11.88 53.4,12.2 53.4,14.4 R15.2
MISO  (via drill 0.4)
  Top 0.254: U2.16 60.05,32 63.5,32 64,32.5 64,47.4 arc-45 64.07,47.57 64.6,48.1 78,48.1 78.2,48.3 v78.2,51.7
  Bottom 0.254: J1.1 83.6,55.9 82.9,55.2 80.9,55.2 79.2,53.5 79.2,52.7 v78.2,51.7
MOSI
  Top 0.254: U2.15 60.11,30.11 61,31 64,31 65,32 65,46.4 arc-45 65.07,46.57 65.5,47 77.8,47 79.3,48.5 79.3,58.08 J1.4
N$1
  Top 0.254: U2.20 55,32.47 55,35.27 C5.1
N$2
  Top 0.305: T2.B 51.15,57.95 T1.E 48.3,58.1 R1.1
N$3
  Top 0.254: U$2.SHIELD2 U$2.SHIELD1 9.5,37.1 JP4.2 JP3.2
N$4
  Top 0.305: R4.1 53,48.95 53,51 | 53,51 51.6,51 T4.B | T3.E 54.9,51 53,51
N$5
  Top 0.254: R7.2 LED2.A
N$6
  Top 0.305: CSTCE16.0.1 58.6,21.5 57.5,21.5 57.5,23.82 U2.8
N$7  (via drill 0.4)
  Top 0.406: J2.VBUS 84,29 v84,24.5
  Top 0.813: U4.4 U4.2 v76,14 | v84,24.5 81.45,24.5 F1.1
  Bottom 0.813: v76,14 84,22 v84,24.5 84,30 80,34 80,48.8 81,49.8 U$4.VBUS
N$8  (via drill 0.4)
  Top 0.813: X1.1 78.3,8.6 v78.2,8.7 | v75.9,18.5 75.9,18.11 U4.3
  Bottom 0.813: v78.2,8.7 73,8.7 70.8,10.9 70.8,13.4 v75.9,18.5
N$9
  Top 0.254: R8.2 LED3.A
N$10
  Top 0.254: R6.2 LED1.A
N$11
  Top 0.254: T13.E 15.25,27.93 | 15.25,27.93 15.25,29.08 T14.B | R16.1 15.25,27.93
N$12
  Top 0.254: R9.2 LED4.A
N$13
  Top 0.254: R10.2 LED5.A
N$14
  Top 0.254: 20.3,26.88 T15.E 20.65,27.33 | 20.65,27.33 21.25,27.93 T16.B | R22.1 22.8,27.33 20.65,27.33
N$15
  Top 0.254: T22.B 14.2,13.18 T21.E 13.8,12.78 R24.1
N$16
  Top 0.254: R11.2 LED6.A
N$17
  Top 0.254: T23.E 21.15,15.13 T24.B 21.25,16.68 R28.1
N$18
  Top 0.305: CSTCE16.0.3 56.2,21.5 56.67,21.5 U2.7
N$19
  Top 0.254: JP7.2 JP6.2 | JP7.2 27.73,37.18 | JP7.2 27,36.45 27,11.2 27.8,10.4 27.8,8.2 U$3.SHIELD1 U$3.SHIELD2
N$21
  Top 0.254: T25.E 33.48,28.01 | 33.48,28.01 33.48,29.16 T26.B | R32.1 33.48,28.01
N$22
  Top 0.254: 38.53,26.96 T27.E 38.88,27.41 | 38.88,27.41 39.48,28.01 T28.B | R34.1 41.03,27.41 38.88,27.41
N$23
  Top 0.254: R12.2 R18.1 R13.1
N$24
  Top 0.254: D2.2 D1.1
N$26
  Top 0.254: T30.B 32.43,13.26 T29.E 32.03,12.86 R36.1
N$27
  Top 0.254: T31.E 39.38,15.21 T32.B 39.48,16.76 R38.1
PROBE_LED  (via drill 0.4)
  Top 0.254: U2.14 60.31,29.31 61,30 v65,30 | v76.4,53.4 77,54 R11.1
  Bottom 0.254: v65,30 65,35.5 68.5,39 72,39 75,42 75,52 v76.4,53.4
RESET  (via drill 0.4)
  Top 0.254: v48,25.5 48,27.5 48.21,27.71 U2.29 | R3.1 57.65,37.7 57.65,39 | 57.65,39 S3.P$2 59.5,41.5 61.7,43.7 61.7,48.1 64.3,50.7 68.4,50.7 69.7,52 v69.7,53.5 | 57.65,39 v54,39
  Top 0.406: 54,38.85 v54,39
  Bottom 0.254: v54,39 50.38,35.38 U2.29 48.67,26 v48,25.5 | J1.5 83.6,63.5 83,64.1 71.4,64.1 70.6,63.3 70.6,55.3 69.7,54.4 v69.7,53.5
RXD  (via drill 0.4)
  Top 0.305: 57,57 57.8,57 R2.1
  Top 0.406: v57.5,54.5 57.5,56.5 57,57 T2.E | U2.30 51.91,26.91 52.5,27.5 54.5,27.5 v55,27
  Bottom 0.406: v57.5,54.5 57.5,32 57,31.5 55,31.5 54,30.5 54,28.5 55,27.5 v55,27
RXD3.3
  Top 0.254: JP2.2 46.64,50.84 48.3,52.5 T4.E
  Top 0.305: T4.E 50.1,51.8 R5.1
SCALE_1_CLK  (via drill 0.4)
  Top 0.254: R17.1 13.85,32.78 T14.E 13.85,32.85 v15,34 | U2.2 52.67,22 v52,22
  Bottom 0.254: v15,34 16,34 17,35 20.6,35 21.3,35.7 37.2,35.7 39,37.5 44.5,37.5 49,33 49,28 47,26 47,23 48,22 v52,22
SCALE_1_DATA  (via drill 0.4)
  Top 0.254: T16.E 19.1,31.28 19.1,31.9 | 19.1,31.9 R23.1 | 19.1,31.9 v17.5,33.5 | U2.9 60.19,25.31 v61,24.5
  Bottom 0.254: v17.5,33.5 20.6,33.5 21.9,34.8 37.8,34.8 39.5,36.5 44,36.5 48,32.5 48,28.5 46,26.5 46,22.5 48,20.5 59.5,20.5 61,22 v61,24.5
SCALE_1_LED  (via drill 0.4)
  Top 0.254: R7.1 v65,52.5
  Top 0.406: U2.27 54.81,29.31 v55.5,30
  Bottom 0.254: v55.5,30 58,30 59,31 59,35.5 66.5,43 68,43 69,44 69,48.5 v65,52.5
SCALE_2_CLK  (via drill 0.4)
  Top 0.254: R25.1 13.8,19.98 T22.E 15.15,18.65 v16.5,20 | U2.10 60.89,26.11 v64,23
  Bottom 0.254: v16.5,20 18,21.5 18,23 22,27 22,31.8 | 22,31.8 22,32 | v64,23 64,21 61.5,18.5 46.5,18.5 44,21 44,27.5 46,29.5 46,32 43.5,34.5 40.5,34.5 39,33 23.2,33 22,31.8
SCALE_2_DATA  (via drill 0.4)
  Top 0.254: T24.E 18.85,17.63 18.85,20.23 19.2,20.58 R29.1 19.2,21.5 v16.5,21.5 | U2.11 62.09,26.91 v63,26
  Bottom 0.254: v16.5,21.5 16.5,23 21,27.5 21,32.6 22.3,33.9 38.4,33.9 40,35.5 43.5,35.5 47,32 47,29 45,27 45,21.5 47,19.5 60,19.5 63,22.5 v63,26
SCALE_2_LED  (via drill 0.4)
  Top 0.254: v68,52.5 R8.1
  Top 0.406: U2.28 v55.5,28.5
  Bottom 0.254: v55.5,28.5 58.5,28.5 60.5,30.5 60.5,35.5 67,42 69,42 70,43 70,50.5 v68,52.5
SCALE_3_CLK
  Top 0.254: T26.E 32.08,32.86 R33.1 | U2.23 52.67,34 48.67,38 47.5,38 46,39.5 37.62,39.5 R33.1 | R33.1 31.53,33.53
SCALE_3_DATA
  Top 0.254: T28.E 37.33,31.36 R35.1 37.33,35.33 40,38 46,38 47,37 48.5,37 51.87,33.63 U2.24 51.77,32.5
SCALE_3_LED  (via drill 0.4)
  Top 0.254: U2.12 61.71,27.71 v62,28 | v71,52.5 R9.1
  Bottom 0.254: v62,28 62,35.5 67.5,41 69.5,41 71,42.5 v71,52.5
SCALE_4_CLK  (via drill 0.4)
  Top 0.254: T30.E 32.03,20.06 R37.1 32.42,21.5 v34.5,21.5 | v43.8,31 43.59,30.91 U2.25
  Bottom 0.254: v34.5,21.5 40,27 40,31.5 41,32.5 42.5,32.5 43.8,31.3 v43.8,31
SCALE_4_DATA  (via drill 0.4)
  Top 0.254: T32.E 37.08,17.71 37.08,20.31 37.43,20.66 R39.1 36.11,21.11 v35,20 | v44,29.5 44.5,30 50.27,30 U2.26
  Bottom 0.254: v35,20 33.5,20 33,20.5 33,21.5 39,27.5 39,31.5 41,33.5 43,33.5 45,31.5 45,30.5 v44,29.5
SCALE_4_LED  (via drill 0.4)
  Top 0.254: U2.13 61.01,28.51 61.5,29 v63.5,29 | v74,52.5 R10.1
  Bottom 0.254: v74,52.5 74,42.5 71.5,40 68,40 63.5,35.5 v63.5,29
SCK  (via drill 0.4)
  Top 0.254: U2.17 58.07,33 62.5,33 63,33.5 63,47.9 arc-45 63.07,48.07 64,49 76.5,49 v77,49.5
  Bottom 0.254: 83.64,59.8 85.4,59.8 86.2,59 86.2,58.9 86.3,58.8 86.3,55.9 84.9,54.5 81.4,54.5 80.5,53.6 80.5,51.6 78.4,49.5 v77,49.5
  Bottom 0.406: 83.64,59.8 J1.3
TXD3.3
  Top 0.254: JP2.3 45.18,53.38 47.6,55.8 49.95,55.8 T1.B
  Top 0.305: T1.B 50.03,55.92
TXT  (via drill 0.4)
  Top 0.406: U2.31 52.61,26.11 v53,26.5 | v56,48.5 56,49 57.5,50.5 57.5,51.55 T3.B
  Bottom 0.406: v53,26.5 53,31 54.5,32.5 56,32.5 56.5,33 56.5,48 v56,48.5
USN_1_1_2  (via drill 0.4)
  Top 0.254: v19.35,22.93 14.85,22.93 14.3,23.48 T13.B
  Bottom 0.254: U$2.1-2 15.05,8.73 16.05,9.73 16.05,17.33 19.35,20.63 v19.35,22.93
USN_1_1_3  (via drill 0.4)
  Top 0.254: v23.25,23.03 21,23.03 T15.B
  Bottom 0.254: U$2.1-3 17.05,16.83 v23.25,23.03
USN_1_2_2
  Top 0.254: U$2.2-2 13.75,6.32 13.75,10.03 15.8,11.88 T21.B
USN_1_2_3
  Top 0.254: U$2.2-3 18.35,6.12 18.35,8.53 19.3,9.48 T23.B
USN_2_1_2  (via drill 0.4)
  Top 0.254: v37.58,23.01 33.08,23.01 32.53,23.56 T25.B
  Bottom 0.254: v37.58,23.01 37.58,20.71 34.28,17.41 34.28,8.72 U$3.1-2
USN_2_1_3  (via drill 0.4)
  Top 0.254: v41.48,23.11 39.23,23.11 T27.B
  Bottom 0.254: U$3.1-3 35.28,16.91 v41.48,23.11
USN_2_2_2
  Top 0.254: T29.B 34.03,11.96 34.03,10.83 32.1,8.9 32.1,6.48 U$3.2-2
USN_2_2_3
  Top 0.254: T31.B 37.53,9.36 36.58,8.41 36.58,6.4 U$3.2-3

### Text on the board
Top: Andreas Glatz / Messchieber-Bluetooth v2.0 / 03.01.2017
Bottom: Andreas Glatz / Messchieber-Bluetooth v2.0 / 03.01.2017